# EAGLE design QuadDXL (EAGLE 9.5.0)
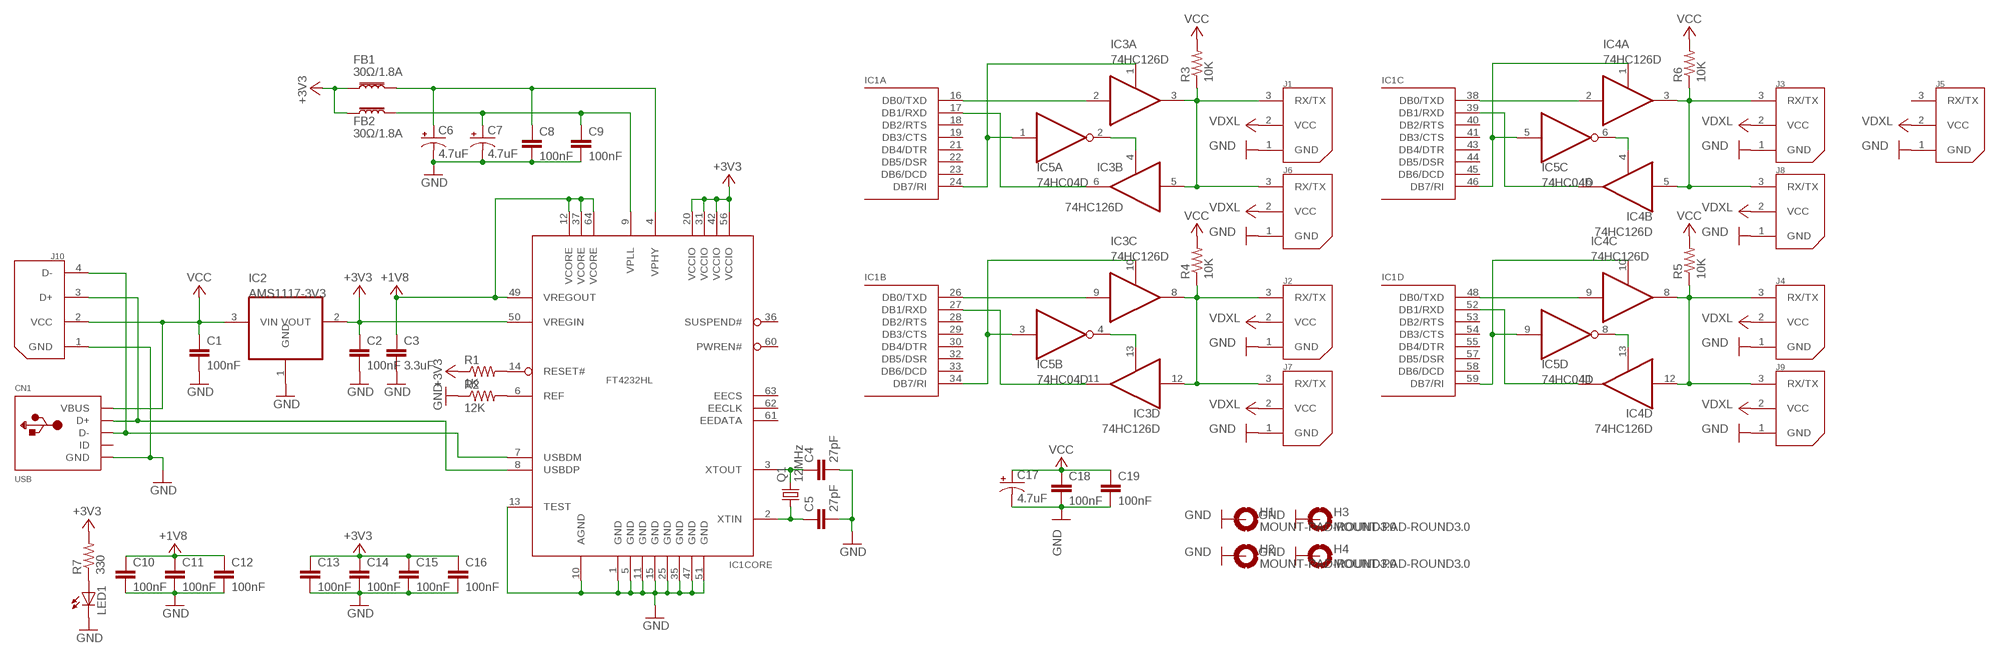
[diagram p0: schematic, sheet 1]

## Parts
C1  100nF  C-EUC0603K  [C0603K]
C2  100nF  C-EUC0603K  [C0603K]
C3  3.3uF  C-EUC0603K  [C0603K]
C4  27pF  C-EUC0603K  [C0603K]
C5  27pF  C-EUC0603K  [C0603K]
C6  4.7uF  CPOL-USCT3216  [CT3216]
C7  4.7uF  CPOL-USCT3216  [CT3216]
C8  100nF  C-EUC0603K  [C0603K]
C9  100nF  C-EUC0603K  [C0603K]
C10  100nF  C-EUC0603K  [C0603K]
C11  100nF  C-EUC0603K  [C0603K]
C12  100nF  C-EUC0603K  [C0603K]
C13  100nF  C-EUC0603K  [C0603K]
C14  100nF  C-EUC0603K  [C0603K]
C15  100nF  C-EUC0603K  [C0603K]
C16  100nF  C-EUC0603K  [C0603K]
C17  4.7uF  CPOL-USCT3216  [CT3216]
C18  100nF  C-EUC0603K  [C0603K]
C19  100nF  C-EUC0603K  [C0603K]
CN1  USB  USBMINIB  [USB-MINIB]
FB1  30Ω/1.8A  FERRITE_BEAD-0603  [0603]
FB2  30Ω/1.8A  FERRITE_BEAD-0603  [0603]
H1  MOUNT-PAD-ROUND3.0  [3,0-PAD]
H2  MOUNT-PAD-ROUND3.0  [3,0-PAD]
H3  MOUNT-PAD-ROUND3.0  [3,0-PAD]
H4  MOUNT-PAD-ROUND3.0  [3,0-PAD]
IC1  FT4232HL  [LQFP64]
IC2  AMS1117-3V3  REG1117  [SOT223]
IC3  74HC126D  [SO14]
IC4  74HC126D  [SO14]
IC5  74HC04D  [SO14]
J1  22-03-5035  [5267-3]
J2  22-03-5035  [5267-3]
J3  22-03-5035  [5267-3]
J4  22-03-5035  [5267-3]
J5  DXL_POWER  22-03-5035  [5267-3]
J6  22-03-5035  [5267-3]
J7  22-03-5035  [5267-3]
J8  22-03-5035  [5267-3]
J9  22-03-5035  [5267-3]
J10  USB  22-03-5045  [5267-4]
LED1  LEDCHIP-LED0603  [CHIP-LED0603]
Q1  12MHz  CRYSTALHC49UP  [HC49UP]
R1  1K  R-US_R0603  [R0603]
R2  12K  R-US_R0603  [R0603]
R3  10K  R-US_R0603  [R0603]
R4  10K  R-US_R0603  [R0603]
R5  10K  R-US_R0603  [R0603]
R6  10K  R-US_R0603  [R0603]
R7  330  R-US_R0603  [R0603]

## Nets
+1V8: C3.1 C10.1 C11.1 C12.1 IC1.12(CORE:VCORE) IC1.37(CORE:VCORE) IC1.49(CORE:VREGOUT) IC1.64(CORE:VCORE)
+3V3: C2.1 C13.1 C14.1 C15.1 C16.1 FB1.1 FB2.1 IC1.20(CORE:VCCIO) IC1.31(CORE:VCCIO) IC1.42(CORE:VCCIO) IC1.50(CORE:VREGIN) IC1.56(CORE:VCCIO) IC2.2(VOUT) R1.1 R7.2
GND: C1.2 C2.2 C3.2 C4.2 C5.2 C6.- C7.- C8.2 C9.2 C10.2 C11.2 C12.2 C13.2 C14.2 C15.2 C16.2 C17.- C18.2 C19.2 CN1.GND H1.B3,0(MOUNT) H2.B3,0(MOUNT) H3.B3,0(MOUNT) H4.B3,0(MOUNT) IC1.1(CORE:GND) IC1.5(CORE:GND) IC1.10(CORE:AGND) IC1.11(CORE:GND) IC1.13(CORE:TEST) IC1.15(CORE:GND) IC1.25(CORE:GND) IC1.35(CORE:GND) IC1.47(CORE:GND) IC1.51(CORE:GND) IC2.1(GND) J1.1(GND) J2.1(GND) J3.1(GND) J4.1(GND) J5.1(GND) J6.1(GND) J7.1(GND) J8.1(GND) J9.1(GND) J10.1(GND) LED1.C R2.1
N$1: CN1.D+ IC1.8(CORE:USBDP) J10.3(D+)
N$2: CN1.D- IC1.7(CORE:USBDM) J10.4(D-)
N$3: LED1.A R7.1
N$4: IC1.14(CORE:RESET#) R1.2
N$5: IC1.6(CORE:REF) R2.2
N$6: C4.1 IC1.3(CORE:XTOUT) Q1.2
N$7: C5.1 IC1.2(CORE:XTIN) Q1.1
N$8: C6.+ C8.1 FB1.2 IC1.4(CORE:VPHY)
N$9: C7.+ C9.1 FB2.2 IC1.9(CORE:VPLL)
N$10: IC1.16(A:DB0/TXD) IC3.2(A:I)
N$11: IC1.17(A:DB1/RXD) IC3.6(B:O)
N$12: IC1.24(A:DB7/RI) IC3.1(A:OE) IC5.1(A:I)
N$13: IC3.4(B:OE) IC5.2(A:O)
N$14: IC3.3(A:O) IC3.5(B:I) J1.3(RX/TX) J6.3(RX/TX) R3.1
N$15: IC1.26(B:DB0/TXD) IC3.9(C:I)
N$16: IC1.27(B:DB1/RXD) IC3.11(D:O)
N$17: IC1.34(B:DB7/RI) IC3.10(C:OE) IC5.3(B:I)
N$18: IC3.13(D:OE) IC5.4(B:O)
N$19: IC3.8(C:O) IC3.12(D:I) J2.3(RX/TX) J7.3(RX/TX) R4.1
N$20: IC1.38(C:DB0/TXD) IC4.2(A:I)
N$21: IC1.39(C:DB1/RXD) IC4.6(B:O)
N$22: IC4.4(B:OE) IC5.6(C:O)
N$23: IC1.46(C:DB7/RI) IC4.1(A:OE) IC5.5(C:I)
N$24: IC1.48(D:DB0/TXD) IC4.9(C:I)
N$25: IC1.59(D:DB7/RI) IC4.10(C:OE) IC5.9(D:I)
N$26: IC4.13(D:OE) IC5.8(D:O)
N$27: IC1.52(D:DB1/RXD) IC4.11(D:O)
N$28: IC4.3(A:O) IC4.5(B:I) J3.3(RX/TX) J8.3(RX/TX) R6.1
N$29: IC4.8(C:O) IC4.12(D:I) J4.3(RX/TX) J9.3(RX/TX) R5.1
VCC: C1.1 C17.+ C18.1 C19.1 CN1.VBUS IC2.3(VIN) J10.2(VCC) R3.2 R4.2 R5.2 R6.2
VDXL: J1.2(VCC) J2.2(VCC) J3.2(VCC) J4.2(VCC) J5.2(VCC) J6.2(VCC) J7.2(VCC) J8.2(VCC) J9.2(VCC)
Unconnected: CN1.ID IC1.18(A:DB2/RTS) IC1.19(A:DB3/CTS) IC1.21(A:DB4/DTR) IC1.22(A:DB5/DSR) IC1.23(A:DB6/DCD) IC1.28(B:DB2/RTS) IC1.29(B:DB3/CTS) IC1.30(B:DB4/DTR) IC1.32(B:DB5/DSR) IC1.33(B:DB6/DCD) IC1.36(CORE:SUSPEND#) IC1.40(C:DB2/RTS) IC1.41(C:DB3/CTS) IC1.43(C:DB4/DTR) IC1.44(C:DB5/DSR) IC1.45(C:DB6/DCD) IC1.53(D:DB2/RTS) IC1.54(D:DB3/CTS) IC1.55(D:DB4/DTR) IC1.57(D:DB5/DSR) IC1.58(D:DB6/DCD) IC1.60(CORE:PWREN#) IC1.61(CORE:EEDATA) IC1.62(CORE:EECLK) IC1.63(CORE:EECS) IC5.10(E:O) IC5.11(E:I) IC5.12(F:O) IC5.13(F:I) J5.3(RX/TX)

## Power pins joined to a net without a drawn wire
GND: IC3.7(P:GND) IC4.7(P:GND) IC5.7(P:GND)
VCC: IC3.14(P:VCC) IC4.14(P:VCC) IC5.14(P:VCC)

## Library data of the parts
C1-C5 C8-C16 C18 C19 = rcl:C-EU: CAPACITOR, European symbol; SPICEPREFIX: C
C6 C7 C17 = rcl:CPOL-US: POLARIZED CAPACITOR, American symbol; SPICEPREFIX: C
CN1 = adafruit:USB: USB Connectors USBMINIB - Surface Mount Female Mini-B USB Connector 4UConnector: 06564 By microbuilder.eu Thru-hole RA Female Mini-B USB Connector 4UConnector: 18732 By ladyada.net
FB1 FB2 = SparkFun-Coils:FERRITE_BEAD: Ferrite Bead (blocks, cores, rings, chokes, etc.) Inductor with layers of ferrite used to suppress high frequencies. Often used to isolate high frequency noise. SparkFun Products: IOIO-OTG - V2.2 <https://www.sparkfun.com/products/13613> SparkFun SAMD21 Mini Breakout <https://www.sparkfun.com/products/13664> SparkFun 6 Degrees of Freedom Breakout - LSM6DS3 <https://www.sparkfun.com/products/13339> SparkFun SAMD21 Dev Breakout <https://www.sparkfun.com/products/13672>; PROD_ID: NDUC-07859
H1-H4 = holes:MOUNT-PAD-ROUND: MOUNTING PAD, round
IC1 = ftdichip-6:FT4232H: Quad USB UART 5th generation USB to 4-port serial controller
IC2 = burr-brown:REG1117: 800mA and 1A Low Dropout (LDO) Positive Regulator 1.8V, 2.5V, 2.85V, 3.3V, 5V, and Adj; MPN: REG1117; OC_FARNELL: 1097566; OC_NEWARK: 14P6981
IC3 IC4 = 74xx-eu:74*126: Quad bus BUFFER, 3-state
IC5 = 74xx-eu:74*04: Hex INVERTER
J1-J9 = molex:22-03-5035: Molex SPOX Vert, Tin (Dynamixel AX/MX Bus) tested: YES (arbotix)
J10 = molex:22-03-5045: Molex SPOX Vert, Tin (Dynamixel RX Bus) tested: YES (arbotix2)
LED1 = adafruit:LED: LED OSRAM: - CHIPLED LG R971, LG N971, LY N971, LG Q971, LY Q971, LO R971, LY R971 LH N974, LH R974 LS Q976, LO Q976, LY Q976 LO Q996 - Hyper CHIPLED LW Q18S LB Q993, LB Q99A, LB R99A - SideLED LS A670, LO A670, LY A670, LG A670, LP A670 LB A673, LV A673, LT A673, LW A673 LH A674 LY A675 LS A676, LA A676, LO A676, LY A676, LW A676 LS A679, LY A679, LG A679 - Hyper Micro SIDELED® LS Y876, LA Y876, LO Y876, LY Y876 LT Y87S - SmartLED LW L88C, LW L88S LB L89C, LB L89S, LG L890 LS L89K, LO L89K, LY L89K LS L896, LA L896, LO L896, LY L896 - TOPLED LS T670, LO T670, LY T670, LG T670, LP T670 LSG T670, LSP T670, LSY T670, LOP T670, LYG T670 LG T671, LOG T671, LSG T671 LB T673, LV T673, LT T673, LW T673 LH T674 LS T676, LA T676, LO T676, LY T676, LB T676, LH T676, LSB T676, LW T676 LB T67C, LV T67C, LT T67C, LS T67K, LO T67K, LY T67K, LW E67C LS E67B, LA E67B, LO E67B, LY E67B, LB E67C, LV E67C, LT E67C LW T67C LS T679, LY T679, LG T679 LS T770, LO T770, LY T770, LG T770, LP T770 LB T773, LV T773, LT T773, LW T773 LH T774 LS E675, LA E675, LY E675, LS T675 LS T776, LA T776, LO T776, LY T776, LB T776 LHGB T686 LT T68C, LB T68C - Hyper Mini TOPLED® LB M676 - Mini TOPLED Santana® LG M470 LS M47K, LO M47K, LY M47K Source: http://www.osram.convergy.de/
Q1 = adafruit:CRYSTAL: CRYSTAL; OC_FARNELL: unknown; OC_NEWARK: unknown
R1-R7 = rcl:R-US_: RESISTOR, American symbol; SPICEPREFIX: R

## Board
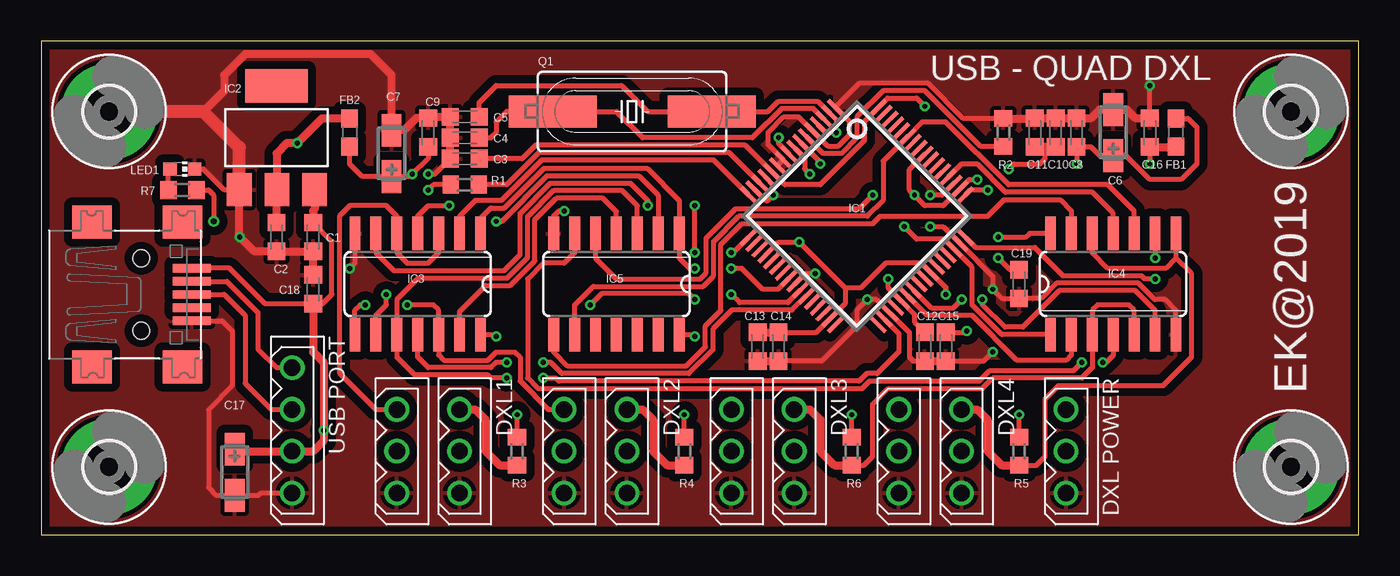
[diagram p1: board, top side]
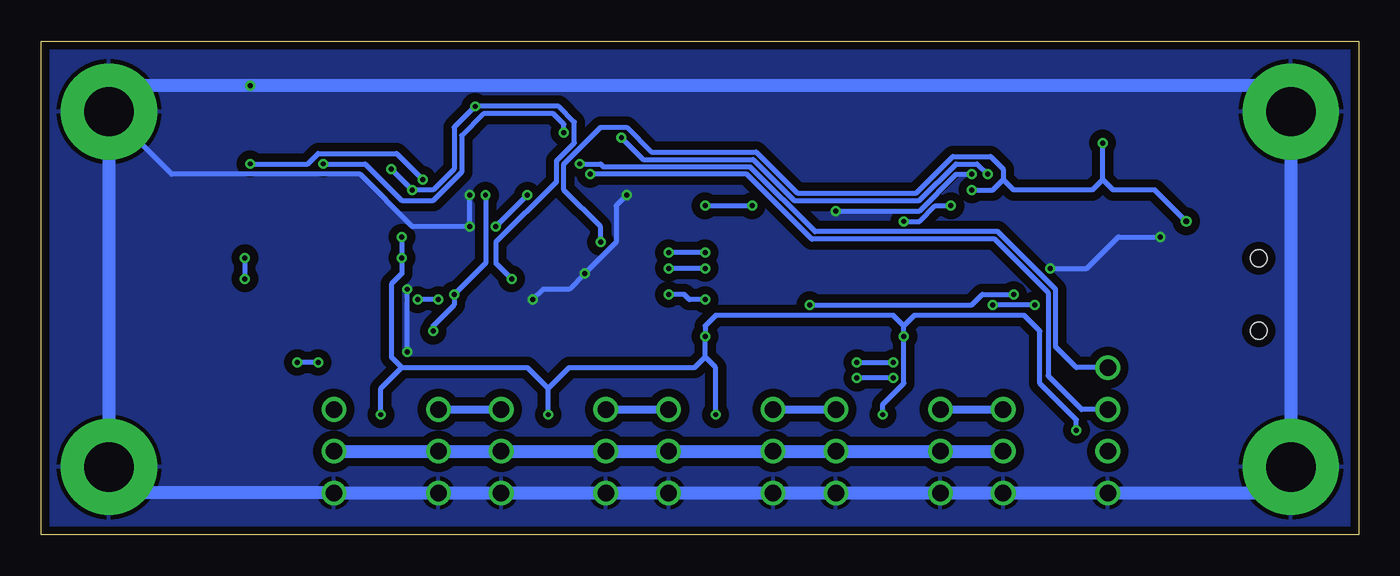
[diagram p2: board, bottom side, seen from below]

Size 80 x 30 mm. Coordinates in mm from the lower left corner, seen from the top.
Outline: 0,0 80,0 80,30 0,30 0,0
Copper layers (1*16): Top 0.035mm / dielectric 1.5mm / Bottom 0.035mm
Design rules "SparkFun-2-layer-PCBWay-LIMIT": minimum track width 6mil, minimum drill 0.3mm, track to track 6mil, track to pad 6mil, pad to pad 6mil, via to via 6mil, smd to smd 6mil, copper to edge 6mil, drill to drill 6mil, minimum pad ring 6mil, minimum via ring 6mil, stop-mask expansion 4mil, vias tented up to drill 25mil, thermal gap 10mil

### Footprints (pad centres in the part's own frame; a part is rotated, then mirrored left to right if it is on the bottom)
C0603K = smd 1.05 x 1.08: 1 -0.875,0; 2 0.875,0
CT3216 = smd 2 x 1.2: + -1.4,0; - 1.4,0
USB-MINIB = smd 0.5 x 2.308: D+ 0,4.064; D- -0.8,4.064; GND 1.6,4.064; ID 0.8,4.064; VBUS -1.6,4.064 | smd 2 x 2.4: GND1 -4.4,-2; GND2 -4.4,3.5; GND3 4.4,3.5; GND4 4.4,-2 | hole 1: -2.2,1; 2.2,1
0603 = smd 1.1 x 1: 1 -0.85,0; 2 0.85,0
3,0-PAD = drill 3 pad 5.842: B3,0 0,0
LQFP64 = smd 0.25 x 1.2: 1 -3.75,-5.6; 2 -3.25,-5.6; 3 -2.75,-5.6; 4 -2.25,-5.6; 5 -1.75,-5.6; 6 -1.25,-5.6; 7 -0.75,-5.6; 8 -0.25,-5.6; 9 0.25,-5.6; 10 0.75,-5.6; 11 1.25,-5.6; 12 1.75,-5.6; 13 2.25,-5.6; 14 2.75,-5.6; 15 3.25,-5.6; 16 3.75,-5.6; 33 3.75,5.6; 34 3.25,5.6; 35 2.75,5.6; 36 2.25,5.6; 37 1.75,5.6; 38 1.25,5.6; 39 0.75,5.6; 40 0.25,5.6; 41 -0.25,5.6; 42 -0.75,5.6; 43 -1.25,5.6; 44 -1.75,5.6; 45 -2.25,5.6; 46 -2.75,5.6; 47 -3.25,5.6; 48 -3.75,5.6 | smd 1.2 x 0.25: 17 5.6,-3.75; 18 5.6,-3.25; 19 5.6,-2.75; 20 5.6,-2.25; 21 5.6,-1.75; 22 5.6,-1.25; 23 5.6,-0.75; 24 5.6,-0.25; 25 5.6,0.25; 26 5.6,0.75; 27 5.6,1.25; 28 5.6,1.75; 29 5.6,2.25; 30 5.6,2.75; 31 5.6,3.25; 32 5.6,3.75; 49 -5.6,3.75; 50 -5.6,3.25; 51 -5.6,2.75; 52 -5.6,2.25; 53 -5.6,1.75; 54 -5.6,1.25; 55 -5.6,0.75; 56 -5.6,0.25; 57 -5.6,-0.25; 58 -5.6,-0.75; 59 -5.6,-1.25; 60 -5.6,-1.75; 61 -5.6,-2.25; 62 -5.6,-2.75; 63 -5.6,-3.25; 64 -5.6,-3.75
SOT223 = smd 1.499 x 2.007: 1 -2.261,-3.15; 2 0.025,-3.15; 3 2.311,-3.15 | smd 3.81 x 2.007: 4 0,3.15
SO14 = smd 0.66 x 2.032: 1 -3.81,-3.073; 2 -2.54,-3.073; 3 -1.27,-3.073; 4 0,-3.073; 5 1.27,-3.073; 6 2.54,-3.073; 7 3.81,-3.073; 8 3.81,3.073; 9 2.54,3.073; 10 1.27,3.073; 11 0,3.073; 12 -1.27,3.073; 13 -2.54,3.073; 14 -3.81,3.073
5267-3 = drill 1: 1 0,0; 2 -2.54,0; 3 -5.08,0
5267-4 = drill 1: 1 0,0; 2 -2.54,0; 3 -5.08,0; 4 -7.62,0
CHIP-LED0603 = smd 0.8 x 0.8: A 0,-0.75; C 0,0.75
HC49UP = smd 5.334 x 1.93: 1 -4.826,0; 2 4.826,0
R0603 = smd 1 x 1.1: 1 -0.85,0; 2 0.85,0

### Placement (x,y rotation side)
C1  16.51,18.1 270 top
C2  14.29,18.1 270 top
C3  25.72,22.86 180 top
C4  25.72,24.13 180 top
C5  25.72,25.4 180 top
C6  65.09,24.45 90 top
C7  21.27,23.18 90 top
C8  62.87,24.45 90 top
C9  23.5,24.45 90 top
C10  61.59,24.45 90 top
C11  60.33,24.45 90 top
C12  53.66,11.43 270 top
C13  43.5,11.43 270 top
C14  44.77,11.43 270 top
C15  54.93,11.43 270 top
C16  67.31,24.45 90 top
C17  11.75,3.81 270 top
C18  16.51,14.92 90 top
C19  59.37,15.24 270 top
CN1  5.08,14.61 270 top
FB1  68.9,24.45 90 top
FB2  18.73,24.45 270 top
H1  4.13,4.13 0 top
H2  4.13,25.72 0 top
H3  75.88,25.72 0 top
H4  75.88,4.13 0 top
IC1  49.53,19.37 225 top
IC2  14.29,24.13 0 top
IC3  22.86,15.24 180 top
IC4  65.09,15.24 0 top
IC5  34.92,15.24 180 top
J1  21.59,2.54 270 top
J2  31.75,2.54 270 top
J3  41.91,2.54 270 top
J4  52.07,2.54 270 top
J5  62.23,2.54 270 top
J6  25.4,2.54 270 top
J7  35.56,2.54 270 top
J8  45.72,2.54 270 top
J9  55.88,2.54 270 top
J10  15.24,2.54 270 top
LED1  8.57,22.23 270 top
Q1  35.88,25.72 180 top
R1  25.72,21.27 0 top
R2  58.42,24.45 270 top
R3  28.89,5.08 90 top
R4  39.05,5.08 90 top
R5  59.37,5.08 90 top
R6  49.21,5.08 90 top
R7  8.57,20.95 0 top

### Tracks (layer width: path | path; a pad name or v marks a point on that pad's centre or on a via)
+1V8  (via drill 0.3)
  Top 0.3: C3.1 29.2,22.86 30.02,23.68 42.74,23.68 IC1.12 45.15,21.27 47.31,21.27 49.98,23.94 49.98,25.12 IC1.64 51.39,26.54 53.16,26.54 v53.66,26.04 | C12.1 53.02,12.94 53.02,13.4 IC1.37 51.44,14.99 v51.44,15.56 | IC1.49 56.42,20.95 v57.47,20.95 | v58.74,22.23 59.05,22.54 60.64,22.54 60.96,22.86 60.96,23.57
  Top 0.5: C11.1 60.96,23.57 C10.1
  Bottom 0.3: v58.74,22.23 v57.47,20.95 56.2,20.95 54.93,22.23 54.93,24.76 v53.66,26.04 48.58,26.04 47.62,25.08 47.62,23.82 48.71,22.73 48.71,21.45 52.39,17.78 52.39,16.51 v51.44,15.56
+3V3  (via drill 0.3, 0.35)
  Top 0.3: C14.1 47.06,12.3 IC1.31 48.81,14.05 48.81,15.01 | IC1.56 52.7,22.19 52.7,20.95 v53.02,20.64 53.66,20 54.76,20 IC1.50 56.35,21.59 v56.83,21.59 | IC1.20 44.76,17.78 v46.04,17.78 48.81,15.01 | 48.81,15.01 49.76,15.01 51.27,16.51 53.45,16.51 IC1.42 54.93,15.03 v54.93,14.61 | C15.1 56.12,12.3 v56.2,12.38 | R1.1 23.81,21.27 v23.5,20.95 | C16.1 v67.31,22.54 | R7.2 10.16,20.95 10.48,20.64 v10.48,19.05
  Top 0.5: C2.1 14.29,20.95 | 14.29,20.95 IC2.2 | FB2.1 17.04,25.3 v15.56,23.81 14.92,23.81 14.29,23.18 14.29,20.95 | C13.1 C14.1 | C16.1 68.87,23.57 FB1.1
  Bottom 0.3: v56.2,12.38 56.2,12.7 54.93,13.97 v54.93,14.61 53.02,16.51 v53.02,20.64 | v46.04,17.78 46.04,18.73 48.26,20.95 48.26,22.54 46.04,24.77 44.45,24.77 42.95,23.27 36.59,23.27 34.09,20.77 26.86,20.77 24.64,23 22.36,23 21.59,22.23 21.59,21.59 | 15.56,21.59 16.19,20.95 20.95,20.95 21.59,21.59 | 15.56,21.59 v15.56,23.81 | v67.31,22.54 63.82,22.54 63.18,23.18 58.42,23.18 v56.83,21.59 | v10.48,19.05 12.38,20.95 14.92,20.95 15.56,21.59 | 21.59,21.59 22.23,20.95 v23.5,20.95
GND  (via drill 0.3)
  Top 0.3: C12.2 52.95,10.55 52.7,10.79 52.7,12.3 IC1.35 50.72,14.29 v50.16,14.29 49.53,13.65 49.53,12.7 47.38,10.55 C14.2 | IC1.11 IC1.10 44.13,23.7 44.13,24.44 45.09,25.4 45.97,25.4 IC1.5 47.74,23.63 48.39,23.63 49.08,24.32 49.08,25.12 IC1.1 49.68,27.44 53.84,27.44 55.99,25.3 R2.1 | IC1.11 | IC1.13 44.45,21.27 v44.45,20.64 44.13,20.32 43.98,20.32 IC1.15 | CN1.GND 10.99,13.01 11.61,12.38 11.61,9.07 10.16,7.62 10.16,2.86 10.61,2.41 C17.- 13.21,2.41 13.34,2.54 J10.1 | IC4.7 68.9,13.65 68.26,14.29 67.62,14.29 66.62,15.29 61.64,15.29 60.72,14.37 C19.2 58.34,14.37 v57.78,14.92 57.78,15.71 IC1.47 54.76,18.73 v53.98,18.73 | C15.2 57.23,10.55 v57.78,11.11 | IC5.7 31.11,19.37 31.43,19.68 v31.75,19.68 | C3.2 23.89,21.91 v23.5,21.91 | IC3.7 19.05,16.51 v18.73,16.19 | IC1.51 54.69,20.64 v53.98,20.64 | IC1.25 46.39,15.88 v46.99,15.88 | C16.2 v67.31,27.3 | LED1.C 9.84,22.23 11.09,20.98 IC2.1
  Top 0.5: C3.2 C4.2 C5.2 23.57,25.4 C9.2 22.78,25.32 22.04,24.58 C7.- 21.27,27.94 20,29.21 12.38,29.21 11.11,27.94 11.11,26.99 9.84,25.72 | C13.2 C14.2 | C12.2 C15.2 | R2.1 60.3,25.3 C11.2 C10.2 C8.2 63.74,25.32 64.27,25.85 C6.- 65.91,25.85 66.44,25.32 C16.2 | C18.2 C1.2 C2.2 12.94,17.22 v12.06,18.1 12.03,18.14 IC2.1
  Top 0.8: IC2.1 12.03,23.53 9.84,25.72 H2.B3,0
  Bottom 0.3: v57.78,11.11 v57.78,14.92 | v23.5,21.91 24.45,21.91 26.67,19.68 v31.75,19.68 | v18.73,16.19 16.51,16.19 14.61,18.1 v12.06,18.1 | v53.98,20.64 v53.98,18.73 57.47,18.73 60.64,21.91 72.07,21.91 H3.B3,0 | v50.16,14.29 49.53,14.92 47.94,14.92 v46.99,15.88 45.09,17.78 45.09,20 v44.45,20.64
  Bottom 0.8: J5.1 J9.1 J4.1 J8.1 J3.1 J7.1 J2.1 J6.1 J1.1 J10.1 5.71,2.54 H1.B3,0 H2.B3,0 5.71,27.3 v67.31,27.3 74.3,27.3 H3.B3,0 H4.B3,0 74.3,2.54 J5.1
  pour Top (isolate 0.5): 0,30 0,0 80,0 80,30
  pour Bottom (isolate 0.5): 0,30 0,0 80,0 80,30
N$1  (via drill 0.3)
  Top 0.3: CN1.D+ 11.11,14.61 12.38,13.34 12.38,9.21 13.97,7.62 J10.3 | IC1.8 46.35,22.9 46.35,22.23 v46.67,21.91
  Bottom 0.3: J10.3 16.83,7.62 18.87,9.66 18.87,14.73 22.09,17.96 33.2,17.96 37.15,21.91 v46.67,21.91
N$2  (via drill 0.3)
  Top 0.3: CN1.D- 11.27,15.4 13.15,13.52 13.15,11.29 14.29,10.16 J10.4 | IC1.7 47.31,22.65 v47.31,22.54
  Bottom 0.3: J10.4 17.14,10.16 18.41,11.43 18.41,14.92 21.91,18.41 33.02,18.41 36.96,22.36 45.85,22.36 46.04,22.54 v47.31,22.54
N$3
  Top 0.3: R7.1 7.72,22.12 LED1.A
N$4
  Top 0.3: IC1.14 41.78,23.23 30.2,23.23 28.25,21.27 R1.2
N$5
  Top 0.3: R2.2 57.05,23.6 53.66,26.99 51.12,26.99 49.53,25.4 49.53,24.13 48.58,23.18 47.49,23.18 IC1.6
N$6
  Top 0.3: IC1.3 46.89,25.9 44.95,25.9 43.18,24.13 36.51,24.13 34.92,25.72 Q1.2 28.26,25.72 27.62,25.08 27.62,24.45 27.3,24.13 C4.1
N$7
  Top 0.3: IC1.2 47.14,26.35 44.76,26.35 44.13,25.72 Q1.1 36.83,25.72 35.24,27.3 27.62,27.3 26.59,26.27 C5.1
N$8  (via drill 0.3)
  Top 0.3: FB1.2 69.64,25.3 70.17,24.77 70.17,22.54 69.22,21.59 67.31,21.59 65.85,23.05 C6.+ 64.27,23.05 63.74,23.57 C8.1 v62.87,22.54 | IC1.4 47.63,24.45 v48.26,24.45
  Bottom 0.3: v62.87,22.54 60.33,22.54 58.1,20.32 56.2,20.32 54.48,22.04 54.48,24.26 53.16,25.58 48.9,25.58 48.26,24.95 v48.26,24.45
N$9  (via drill 0.3)
  Top 0.3: C9.1 23.5,22.86 v22.54,21.91 22.41,21.78 C7.+ 19.5,21.78 18.73,22.54 FB2.2 | IC1.9 44.77,23.78 v44.77,24.13
  Bottom 0.3: v44.77,24.13 43.45,22.81 36.77,22.81 34.28,20.32 26.68,20.32 24.45,22.54 23.18,22.54 v22.54,21.91
N$10
  Top 0.3: IC1.16 40.82,22.77 30.39,22.77 27.94,20.32 26.35,20.32 25.4,19.37 IC3.2
N$11  (via drill 0.3)
  Top 0.3: IC3.6 20.32,17.14 21.41,16.06 28.11,16.06 29.07,17.02 29.07,19.54 30.91,21.37 35.77,21.37 36.83,20.31 v36.83,20 | IC1.17 42,17.14 v41.91,17.14 | v39.69,17.14 v39.69,20
  Bottom 0.3: v39.69,17.14 v41.91,17.14 | v39.69,20 v36.83,20
N$12  (via drill 0.3)
  Top 0.3: IC1.24 44.73,14.92 43.81,14.92 42.55,16.19 v41.91,16.19 | IC3.1 26.67,19.23 27.3,19.87 28.13,19.87 30.53,22.27 36.78,22.27 38.73,20.32 IC5.1 38.73,16.83 39.37,16.19 v39.69,16.19
  Bottom 0.3: v39.69,16.19 v41.91,16.19
N$13  (via drill 0.3)
  Top 0.3: IC5.2 37.47,20.63 36.28,21.82 30.72,21.82 27.95,19.05 v27.62,19.05 | IC3.4 22.86,19.37 23.5,20 v24.77,20
  Bottom 0.3: v24.77,20 25.71,20 26.66,19.05 v27.62,19.05
N$14
  Top 0.3: IC3.3 24.13,17.14 23.5,16.51 22.23,16.51 21.59,17.14 IC3.5 21.59,19.37 20.95,20 18.73,20 18.1,19.37 18.1,9.84 20.32,7.62 J1.3
  Top 0.5: J6.3 26.35,7.62 26.99,6.99 26.99,5.08 27.84,4.23 R3.1
  Bottom 0.5: J6.3 J1.3
N$15  (via drill 0.3)
  Top 0.3: IC3.9 20.32,13.34 20.95,13.97 v20.95,14.61 | IC1.26 45.33,14.11 42.41,14.11 v41.91,14.61 | v39.69,14.29 39.32,14.65 34.02,14.65 v33.34,13.97
  Bottom 0.3: v33.34,13.97 23.5,13.97 22.86,14.61 v20.95,14.61 | v39.69,14.29 40.64,14.29 40.96,14.61 v41.91,14.61
N$16  (via drill 0.3)
  Top 0.3: IC3.11 22.86,10.79 23.5,10.16 27.31,10.16 27.63,10.48 v28.26,10.48 | v30.48,10.48 30.93,10.48 31.61,9.79 39.33,9.79 40.77,11.24 40.77,12.51 41.92,13.65 45.58,13.65 IC1.27
  Bottom 0.3: v30.48,10.48 v28.26,10.48
N$17  (via drill 0.3)
  Top 0.3: IC5.3 36.2,20 35.28,20.92 31.09,20.92 29.53,19.35 29.53,16.84 28.3,15.61 22.91,15.61 21.59,14.29 IC3.10 21.59,10.79 22.68,9.71 27.12,9.71 27.3,9.53 v28.26,9.53 | IC1.34 52.07,12.23 52.07,11.11 50.75,9.79 50.11,9.79 49.66,9.34 31.43,9.34 31.25,9.53 v30.48,9.53
  Bottom 0.3: v28.26,9.53 v30.48,9.53
N$18
  Top 0.3: IC5.4 34.92,19.64 34.11,20.46 31.28,20.46 29.98,19.16 29.98,16.65 28.48,15.15 26.99,15.15 25.4,13.56 IC3.13
N$19  (via drill 0.3)
  Top 0.3: IC3.8 19.05,13.65 19.37,13.97 v19.68,13.97 | v22.23,13.97 23.81,13.97 24.13,13.65 IC3.12 24.13,10.93 24.45,10.61 27.12,10.61 27.62,11.11 28.76,11.11 29.07,10.79 29.07,9.34 30.79,7.62 J2.3
  Top 0.5: J7.3 36.51,7.62 37.15,6.99 37.15,5.08 38,4.23 R4.1
  Bottom 0.3: v19.68,13.97 v22.23,13.97
  Bottom 0.5: J7.3 J2.3
N$20
  Top 0.3: IC1.38 53.8,13.34 56.52,13.34 59.24,10.61 62.23,10.61 62.55,10.93 IC4.2
N$21  (via drill 0.3)
  Top 0.3: v57.15,14.29 57.15,13.98 58.51,12.62 59.61,12.62 61.83,14.84 66.44,14.84 67.63,13.64 IC4.6 | IC1.39 54.05,13.79 55.38,13.79 v55.88,14.29
  Bottom 0.3: v55.88,14.29 v57.15,14.29
N$22  (via drill 0.3)
  Top 0.3: v64.45,10.48 64.67,10.48 65.09,10.9 IC4.4 | v63.18,10.48 62.68,9.98 57.6,9.98 56.96,9.34 50.3,9.34 49.85,8.89 30.16,8.89 29.53,9.53 29.53,15.56 30.48,16.51 31.75,16.51 32.38,17.14 IC5.6
  Bottom 0.3: v63.18,10.48 v64.45,10.48
N$23  (via drill 0.3)
  Top 0.3: IC4.1 58.32,12.17 56.52,13.97 56.52,16.27 IC1.46 54.82,17.96 53.16,17.96 v52.39,18.73 | IC5.5 33.66,16.83 34.92,15.56 40.01,15.56 40.37,15.92 40.37,18.02 42.17,19.82 49.66,19.82 v50.48,20.64
  Bottom 0.3: v50.48,20.64 v52.39,18.73
N$24  (via drill 0.3)
  Top 0.3: IC1.48 56.74,17.46 60.33,17.46 62.05,15.74 66.81,15.74 66.99,15.56 v67.63,15.56 | IC4.9 v67.63,16.83
  Bottom 0.3: v67.63,16.83 v67.63,15.56
N$25
  Top 0.3: IC4.10 66.36,19.68 64.77,21.27 58.73,21.27 54.92,25.08 53.48,25.08 IC1.59 51.12,22.72 51.12,20.32 50.16,19.37 42.36,19.37 40.82,17.83 40.82,15.73 40.19,15.11 33.52,15.11 32.38,13.97 IC5.9
N$26
  Top 0.3: IC5.8 31.11,11.11 31.98,10.25 39.14,10.25 40.32,11.43 40.32,12.7 41.27,13.65 41.27,17.64 42.55,18.91 50.49,18.91 50.94,19.37 57.47,19.37 58.47,20.37 61.87,20.37 62.55,19.68 IC4.13
N$27
  Top 0.3: IC4.11 65.09,19.55 63.82,20.82 58.55,20.82 56.85,22.52 55.86,22.52 IC1.52
N$28
  Top 0.3: IC4.5 66.36,13.65 66.04,13.97 64.14,13.97 63.82,13.65 IC4.3 63.82,10.16 63.18,9.53 57.78,9.53 57.15,8.89 51.44,8.89 50.48,7.94 50.48,4.76 49.95,4.23 R6.1
  Top 0.5: J8.3 46.67,7.62 47.31,6.99 47.31,5.08 48.16,4.23 R6.1
  Bottom 0.5: J8.3 J3.3
N$29
  Top 0.3: IC4.8 68.9,16.83 | 68.9,16.83 68.26,16.19 64.77,16.19 63.82,17.14 IC4.12 | 68.9,16.83 69.85,15.88 69.85,10.79 68.13,9.07 61.78,9.07 60.96,8.26 60.96,4.76 60.43,4.23 R5.1
  Top 0.5: J9.3 56.83,7.62 57.47,6.99 57.47,5.08 58.32,4.23 R5.1
  Bottom 0.5: J9.3 J4.3
VCC  (via drill 0.3)
  Top 0.3: CN1.VBUS 11.43,16.2 13.59,14.05 C18.1 17.09,14.05 17.64,14.61 17.64,17.84 C1.1 | IC4.14 60.01,18.31 59.79,18.1 v58.1,18.1 | C19.1 58.81,16.11 v58.1,16.83 | R3.2 v28.89,7.3 | R4.2 v39.05,7.3 | R6.2 v49.21,7.3 | R5.2 v59.37,7.3 | IC5.14 39.59,12.17 v39.69,12.06 | IC3.14 27.52,12.17 v27.62,12.06
  Top 0.5: IC2.3 16.6,19.77 16.51,19.68 C1.1 | C17.+ 11.88,5.08 J10.2 16.51,5.08 17.14,5.71 v17.14,6.35 17.14,10.48 16.51,11.11 C18.1
  Bottom 0.3: v58.1,18.1 v58.1,16.83 58.1,15.88 58.74,15.24 58.74,10.79 58.1,10.16 | v28.89,7.3 28.89,7.94 27.62,9.21 v27.62,12.06 27.62,12.7 | 39.69,10.79 v39.69,12.06 39.69,12.7 39.05,13.34 28.26,13.34 27.62,12.7 | 39.69,10.79 39.05,10.16 v39.05,7.3 | v49.21,7.3 49.21,8.89 | 49.21,8.89 47.94,10.16 40.32,10.16 39.69,10.79 | v59.37,7.3 59.37,8.89 58.1,10.16 | 58.1,10.16 50.48,10.16 49.21,8.89 | v17.14,6.35 17.14,6.99 19.37,9.21 19.37,12.38 20.32,13.34 26.99,13.34 27.62,12.7
VDXL
  Bottom 0.8: J1.2 J6.2 J2.2 J7.2 J3.2 J8.2 J4.2 J9.2 J5.2

### Text on the board
tNames: USB - QUAD DXL | USB PORT | DXL1 | DXL2 | DXL3 | DXL4 | DXL POWER | EK@2019